# Altium schematic sheet 01-POWER.SchDoc
size B
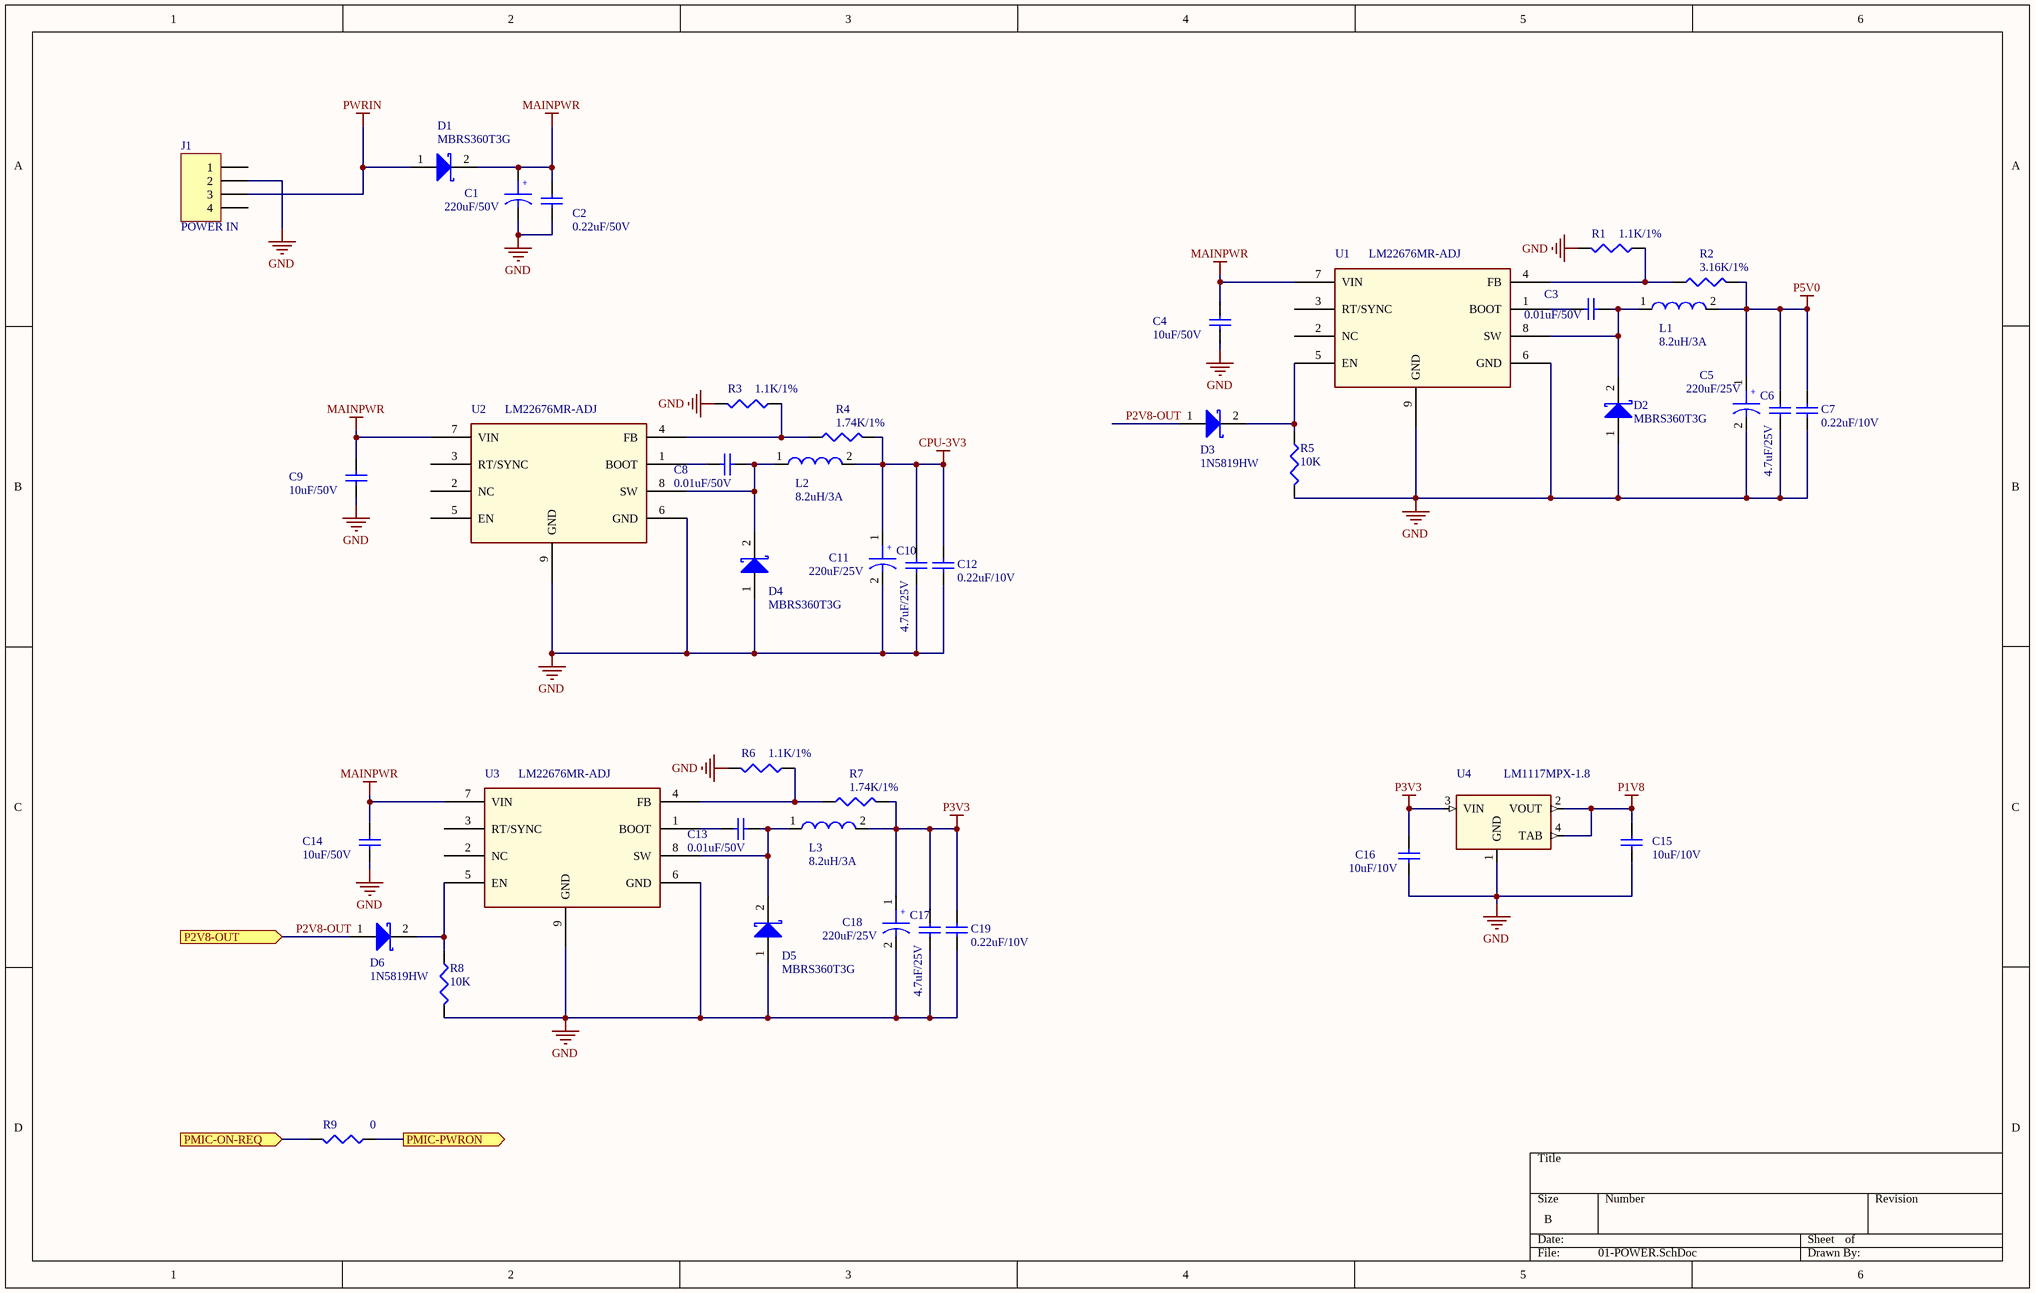
[diagram p0: 01-POWER.SchDoc]

## Parts
C1  220uF/50V  [DL-10*10.5]
C2  0.22uF/50V  [0603]
C3  0.01uF/50V  [0402]
C4  10uF/50V  [1210]
C5  220uF/25V  [DL-8*10.5]
C6  4.7uF/25V  [0805]
C7  0.22uF/10V  [0402]
C8  0.01uF/50V  [0402]
C9  10uF/50V  [1210]
C10  4.7uF/25V  [0805]
C11  220uF/25V  [DL-8*10.5]
C12  0.22uF/10V  [0402]
C13  0.01uF/50V  [0402]
C14  10uF/50V  [1210]
C15  10uF/10V  [0805]
C16  10uF/10V  [0805]
C17  4.7uF/25V  [0805]
C18  220uF/25V  [DL-8*10.5]
C19  0.22uF/10V  [0402]
D1  MBRS360T3G  [SMC]
D2  MBRS360T3G  [SMC]
D3  1N5819HW  [1N5819]
D4  MBRS360T3G  [SMC]
D5  MBRS360T3G  [SMC]
D6  1N5819HW  [1N5819]
J1  POWER IN  [5557-4PIN]
L1  8.2uH/3A  [IND_10X10]
L2  8.2uH/3A  [IND_10X10]
L3  8.2uH/3A  [IND_10X10]
R1  1.1K/1%  [0402]
R2  3.16K/1%  [0402]
R3  1.1K/1%  [0402]
R4  1.74K/1%  [0402]
R5  10K  [0402]
R6  1.1K/1%  [0402]
R7  1.74K/1%  [0402]
R8  10K  [0402]
R9  0  [0402]
U1  LM22676MR-ADJ  [PSO8]
U2  LM22676MR-ADJ  [PSO8]
U3  LM22676MR-ADJ  [PSO8]
U4  LM1117MPX-1.8  [AMS1117]

## Ports
P2V8-OUT (in), PMIC-ON-REQ (in), PMIC-PWRON (out)

## Nets
CPU-3V3: C10.2 C11.1 C12.2 L2.2 R4.2
GND: C1.2 C2.2 C4.2 C5.2 C6.1 C7.1 C9.2 C10.1 C11.2 C12.1 C14.2 C15.2 C16.2 C17.1 C18.2 C19.1 D2.1(A) D4.1(A) D5.1(A) J1.2 R1.2 R3.2 R5.2 R6.2 R8.2 U1.6(GND) U1.9(GND) U2.6(GND) U2.9(GND) U3.6(GND) U3.9(GND) U4.1(GND)
MAINPWR: C1.1 C2.1 C4.1 C9.1 C14.1 D1.2(K) U1.7(VIN) U2.7(VIN) U3.7(VIN)
P1V8: C15.1 U4.2(VOUT) U4.4(TAB)
P3V3: C16.1 C17.2 C18.1 C19.2 L3.2 R7.2 U4.3(VIN)
P5V0: C5.1 C6.2 C7.2 L1.2 R2.2
PWRIN: D1.1(A) J1.3
P2V8-OUT: D3.1(A) D6.1(A) ; port P2V8-OUT
PMIC-ON-REQ: R9.2 ; port PMIC-ON-REQ
PMIC-PWRON: R9.1 ; port PMIC-PWRON
NetC3_1: C3.1 D2.2(K) L1.1 U1.8(SW)
NetC3_2: C3.2 U1.1(BOOT)
NetC8_1: C8.1 D4.2(K) L2.1 U2.8(SW)
NetC8_2: C8.2 U2.1(BOOT)
NetC13_1: C13.1 D5.2(K) L3.1 U3.8(SW)
NetC13_2: C13.2 U3.1(BOOT)
NetD3_2: D3.2(K) R5.1 U1.5(EN)
NetD6_2: D6.2(K) R8.1 U3.5(EN)
NetR1_1: R1.1 R2.1 U1.4(FB)
NetR3_1: R3.1 R4.1 U2.4(FB)
NetR6_1: R6.1 R7.1 U3.4(FB)

Not connected (* = marked no-connect by the designer): J1 1 4; U1 2(NC) 3(RT/SYNC); U2 2(NC) 3(RT/SYNC) 5(EN); U3 2(NC) 3(RT/SYNC)

## Notes on the sheet
- (in symbol CAP WP) +

## Library data of the parts
C1 C5 C11 C18 = CAP WP
C2 C4 C9 C14-C16 = Cap: Capacitor; Published: 8-Jun-2000; LatestRevisionDate: 17-Jul-2002; LatestRevisionNote: Re-released for DXP Platform.; PackageReference: RAD-0.3; Publisher: Altium Limited; PackageDescription: Radial Cap, Thru-Hole; 2 Leads; 0.3 in Pin Spacing
C3 C6-C8 C10 C12 C13 C17 C19 = Cap: Capacitor; Value: 0.1uF; Published: 8-Jun-2000; LatestRevisionDate: 17-Jul-2002; LatestRevisionNote: Re-released for DXP Platform.; PackageReference: RAD-0.3; Publisher: Altium Limited; PackageDescription: Radial Cap, Thru-Hole; 2 Leads; 0.3 in Pin Spacing
D1-D6 = Diode 11DQ03: Schottky Rectifier
J1 = Header 4: Header, 4-Pin; LatestRevisionDate: 17-Jul-2002; LatestRevisionNote: Re-released for DXP Platform.; Publisher: Altium Limited
L1-L3 = 4.7UH_CDH2D09BNP-4R7MC_0.7A_20%: Part Number: SH00000AJ00; ROOM: +1.3V_CORE
R1-R9 = Res3: Resistor; Value: 1K; Published: 8-Jun-2000; LatestRevisionDate: 29-May-2009; LatestRevisionNote: IPC-7351 Footprint Added.; PackageReference: J1-0603; Publisher: Altium Limited; PackageDescription: Chip Resistor
U1-U3 = LM22670_0
U4 = LD1117AS18: IC VREG LDO 1.8V 1A 10V SOT-223; CAD_APPROVED: Yes; MFG_PN01: LD1117AS18TR; MFG_NAME01: ST MICROELECTRONICS; AGILE_PN: 315-78911; CLASS: IC; HEIGHT: 1.9MM; ROHS: Yes